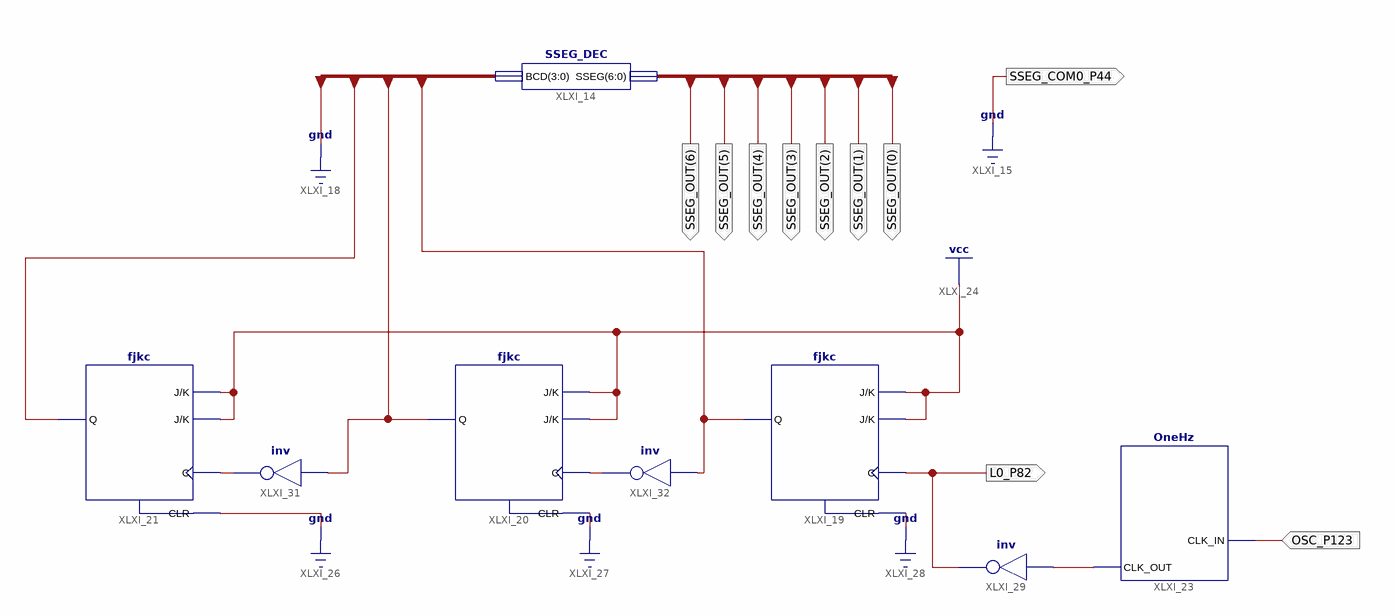
[diagram p0: schematic sheet 1]
// Xilinx ISE schematic main.sch (spartan6) as structural Verilog: 8 symbols, 10 ports
module main (
  input  OSC_P123,
  output [6:0] SSEG_OUT,
  output SSEG_COM0_P44,
  output L0_P82
);

  wire XLXN_35, XLXN_37, XLXN_38;
  wire [2:0] BCD;

  SSEG_DEC XLXI_14 (.BCD({1'b0, BCD}), .SSEG(SSEG_OUT));
  not XLXI_29 (L0_P82, XLXN_35);
  OneHz XLXI_23 (.CLK_IN(OSC_P123), .CLK_OUT(XLXN_35));
  fjkc XLXI_20 (.C(XLXN_37), .CLR(1'b0), .J(1'b1), .K(1'b1), .Q(BCD[1]));
  fjkc XLXI_21 (.C(XLXN_38), .CLR(1'b0), .J(1'b1), .K(1'b1), .Q(BCD[2]));
  not XLXI_32 (XLXN_37, BCD[0]);
  not XLXI_31 (XLXN_38, BCD[1]);
  fjkc XLXI_19 (.C(L0_P82), .CLR(1'b0), .J(1'b1), .K(1'b1), .Q(BCD[0]));

  assign SSEG_COM0_P44 = 1'b0;
endmodule
